# EAGLE design usb-eeprom (EAGLE 6.6.0)
28Cxxx EEPROM Programmer Schematic http://github.com/sstallion/usb-eeprom
REV: 1.01
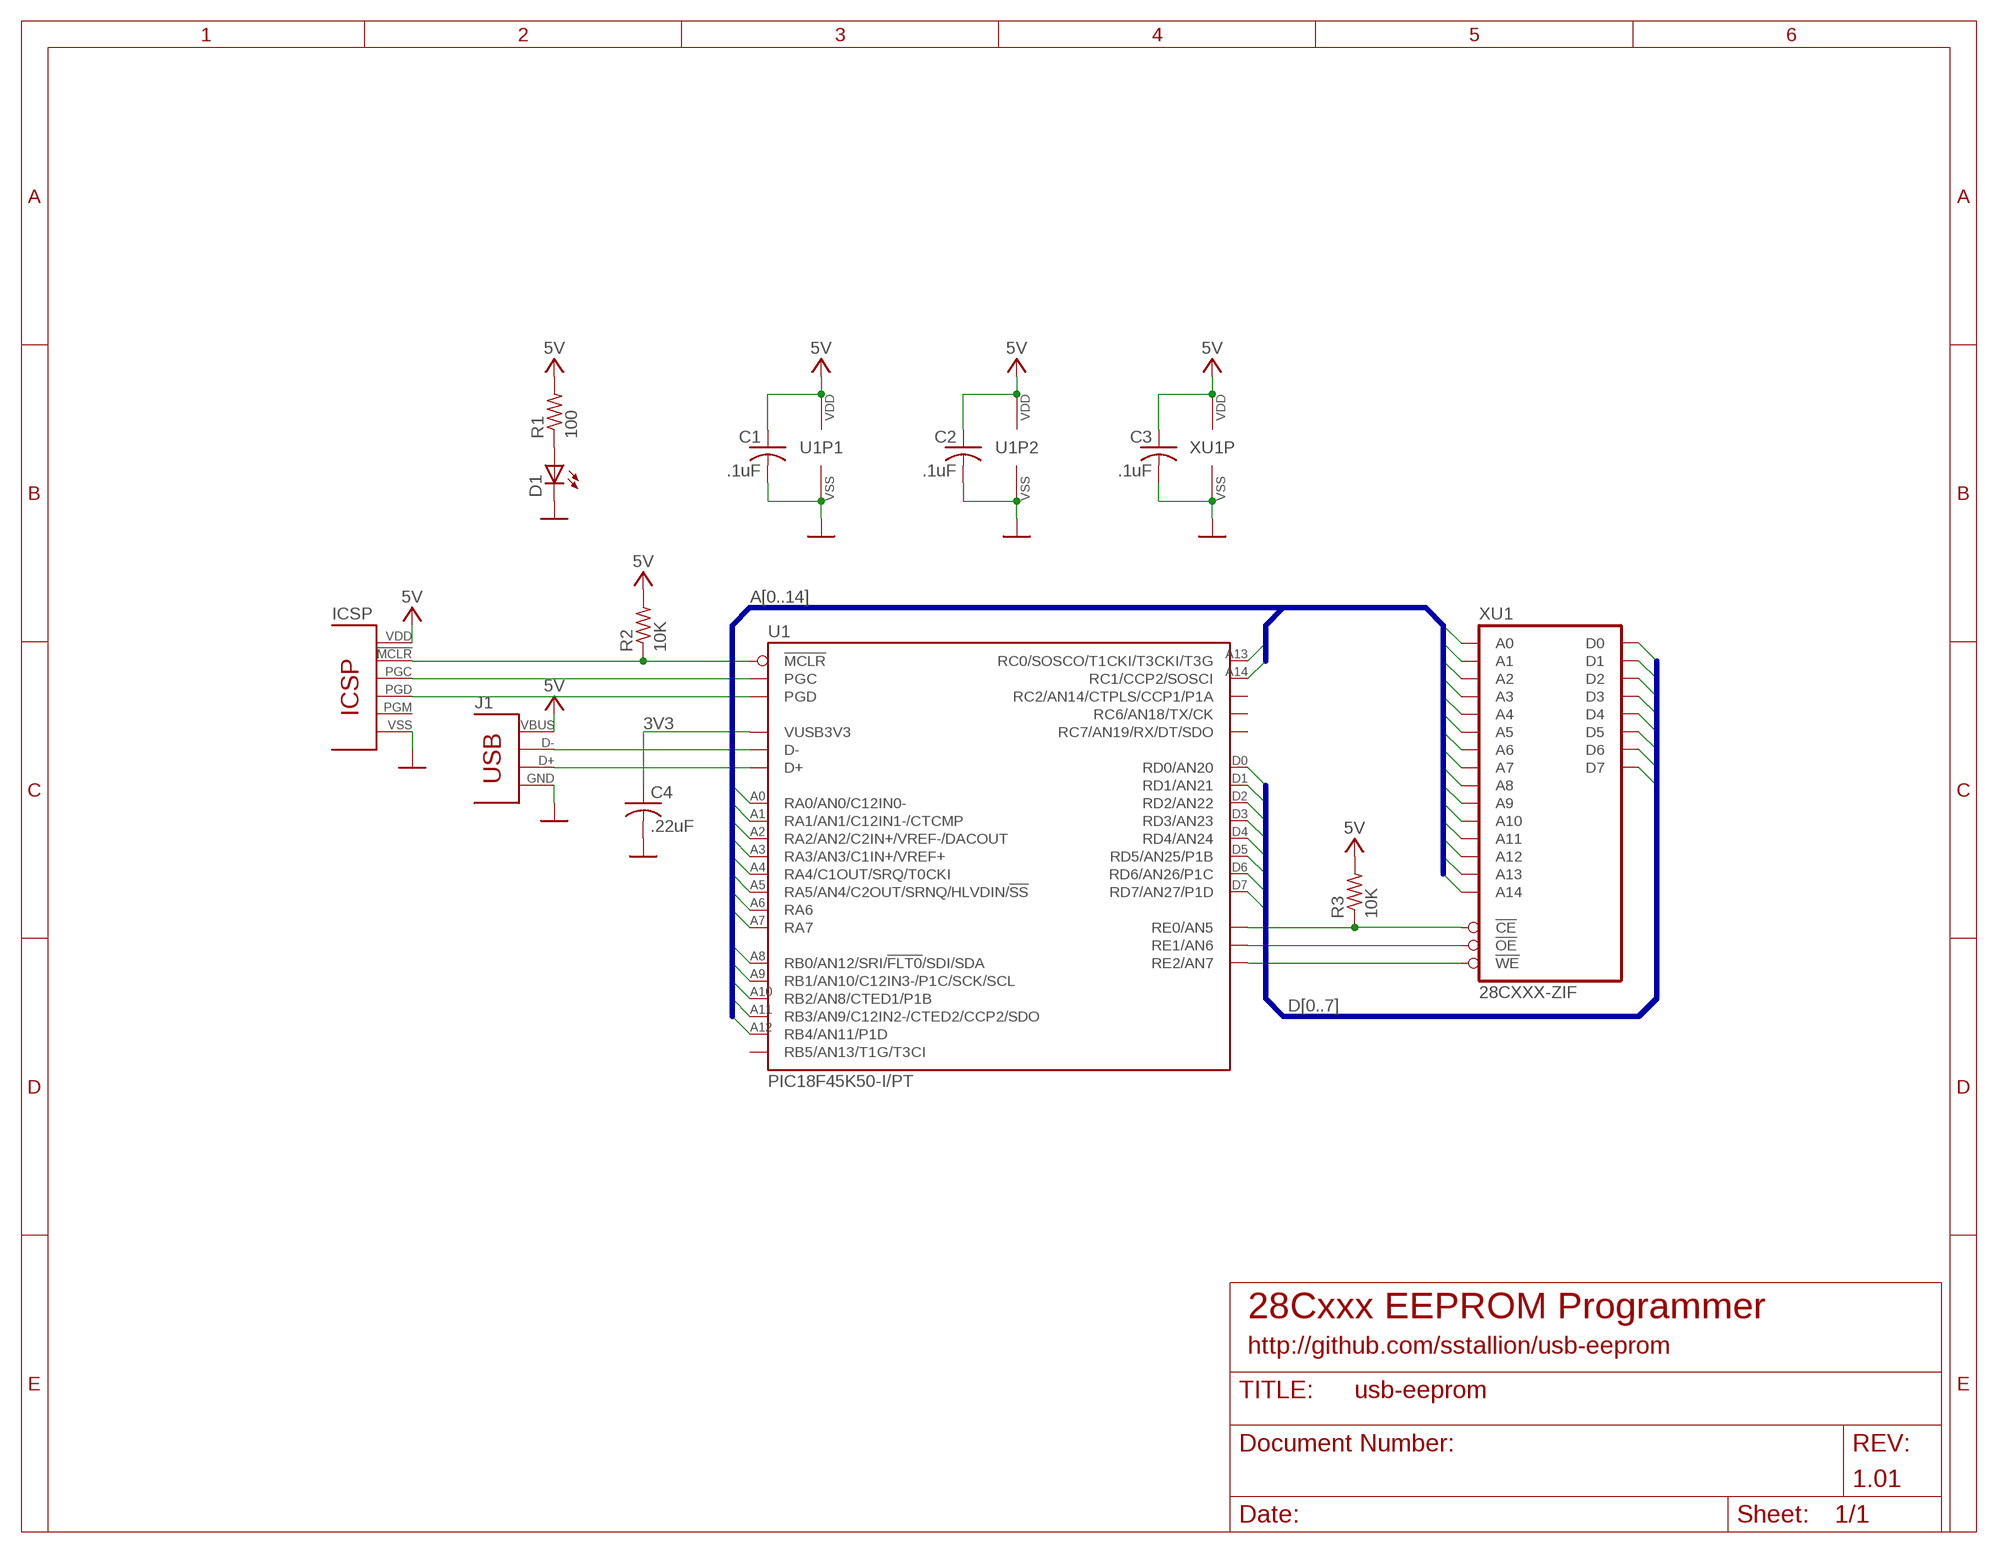
[diagram p0: schematic, sheet 1]

## Parts
C1  .1uF  C-USC0805  [C0805]
C2  .1uF  C-USC0805  [C0805]
C3  .1uF  C-USC0805  [C0805]
C4  .22uF  C-USC0805  [C0805]
D1  BLUE  LEDSML0805  [SML0805]
ICSP  ICSP  [ICSP]
J1  USBA  [USBA]
R1  100  R-US_R0805  [R0805]
R2  10K  R-US_R0805  [R0805]
R3  10K  R-US_R0805  [R0805]
U1  PIC18F45K50-I/PT  [TQFP44]
XU1  28CXXX-ZIF  [ZIF28]

## Nets
+5V: C1.1 C2.1 C3.1 ICSP.2(VDD) J1.1 R1.2 R2.2 R3.2 U1.7(VDD) U1.28(VDD) XU1.28(VDD) ; supply symbol labelled 5V
A0: U1.19(RA0/AN0/C12IN0-) XU1.10(A0)
A1: U1.20(RA1/AN1/C12IN1-/CTCMP) XU1.9(A1)
A2: U1.21(RA2/AN2/C2IN+/VREF-/DACOUT) XU1.8(A2)
A3: U1.22(RA3/AN3/C1IN+/VREF+) XU1.7(A3)
A4: U1.23(RA4/C1OUT/SRQ/T0CKI) XU1.6(A4)
A5: U1.24(RA5/AN4/C2OUT/SRNQ/HLVDIN/!SS!) XU1.5(A5)
A6: U1.31(RA6) XU1.4(A6)
A7: U1.30(RA7) XU1.3(A7)
A8: U1.8(RB0/AN12/SRI/!FLT0!/SDI/SDA) XU1.25(A8)
A9: U1.9(RB1/AN10/C12IN3-/P1C/SCK/SCL) XU1.24(A9)
A10: U1.10(RB2/AN8/CTED1/P1B) XU1.21(A10)
A11: U1.11(RB3/AN9/C12IN2-/CTED2/CCP2/SDO) XU1.23(A11)
A12: U1.14(RB4/AN11/P1D) XU1.2(A12)
A13: U1.32(RC0/SOSCO/T1CKI/T3CKI/T3G) XU1.26(A13)
A14: U1.35(RC1/CCP2/SOSCI) XU1.1(A14)
D0: U1.38(RD0/AN20) XU1.11(D0)
D1: U1.39(RD1/AN21) XU1.12(D1)
D2: U1.40(RD2/AN22) XU1.13(D2)
D3: U1.41(RD3/AN23) XU1.15(D3)
D4: U1.2(RD4/AN24) XU1.16(D4)
D5: U1.3(RD5/AN25/P1B) XU1.17(D5)
D6: U1.4(RD6/AN26/P1C) XU1.18(D6)
D7: U1.5(RD7/AN27/P1D) XU1.19(D7)
GND: C1.2 C2.2 C3.2 C4.2 D1.C ICSP.3(VSS) J1.4 J1.5 J1.6 U1.6(VSS) U1.29(VSS) XU1.14(VSS)
N$1: ICSP.1(!MCLR) R2.1 U1.18(!MCLR)
N$2: ICSP.5(PGC) U1.16(PGC)
N$3: ICSP.4(PGD) U1.17(PGD)
N$4: C4.1 U1.37(VUSB3V3)
N$5: R3.1 U1.25(RE0/AN5) XU1.20(!CE)
N$6: J1.2 U1.42(D-)
N$7: J1.3 U1.43(D+)
N$8: U1.26(RE1/AN6) XU1.22(!OE)
N$9: U1.27(RE2/AN7) XU1.27(!WE)
N$10: D1.A R1.1
Unconnected: ICSP.6(PGM) U1.1(RC7/AN19/RX/DT/SDO) U1.15(RB5/AN13/T1G/T3CI) U1.36(RC2/AN14/CTPLS/CCP1/P1A) U1.44(RC6/AN18/TX/CK)

## Buses
A[0..14]
D[0..7]

## Notes on the sheet
- 3V3
- 28Cxxx EEPROM Programmer
- http://github.com/sstallion/usb-eeprom

## Library data of the parts
C1-C3 = rcl:C-US: CAPACITOR, American symbol; MFG: Vishay; MFG_PN: VJ0805Y104KXJCW1BC; MOUSER_PN: 77-VJ0805Y104KXJCBC; NOTES: X7R MLCC 10% 16V
C4 = rcl:C-US: CAPACITOR, American symbol; MFG: Vishay; MFG_PN: VJ0805Y224KXJTW1BC; MOUSER_PN: 77-VJ0805Y224KXJTBC; NOTES: X7R MLCC 10% 16V
D1 = led:LED: LED OSRAM: - CHIPLED LG R971, LG N971, LY N971, LG Q971, LY Q971, LO R971, LY R971 LH N974, LH R974 LS Q976, LO Q976, LY Q976 LO Q996 - Hyper CHIPLED LW Q18S LB Q993, LB Q99A, LB R99A - SideLED LS A670, LO A670, LY A670, LG A670, LP A670 LB A673, LV A673, LT A673, LW A673 LH A674 LY A675 LS A676, LA A676, LO A676, LY A676, LW A676 LS A679, LY A679, LG A679 - Hyper Micro SIDELED® LS Y876, LA Y876, LO Y876, LY Y876 LT Y87S - SmartLED LW L88C, LW L88S LB L89C, LB L89S, LG L890 LS L89K, LO L89K, LY L89K LS L896, LA L896, LO L896, LY L896 - TOPLED LS T670, LO T670, LY T670, LG T670, LP T670 LSG T670, LSP T670, LSY T670, LOP T670, LYG T670 LG T671, LOG T671, LSG T671 LB T673, LV T673, LT T673, LW T673 LH T674 LS T676, LA T676, LO T676, LY T676, LB T676, LH T676, LSB T676, LW T676 LB T67C, LV T67C, LT T67C, LS T67K, LO T67K, LY T67K, LW E67C LS E67B, LA E67B, LO E67B, LY E67B, LB E67C, LV E67C, LT E67C LW T67C LS T679, LY T679, LG T679 LS T770, LO T770, LY T770, LG T770, LP T770 LB T773, LV T773, LT T773, LW T773 LH T774 LS E675, LA E675, LY E675, LS T675 LS T776, LA T776, LO T776, LY T776, LB T776 LHGB T686 LT T68C, LB T68C - Hyper Mini TOPLED® LB M676 - Mini TOPLED Santana® LG M470 LS M47K, LO M47K, LY M47K Source: http://www.osram.convergy.de LUXEON: - LUMILED® LXK2-PW12-R00, LXK2-PW12-S00, LXK2-PW14-U00, LXK2-PW14-V00 LXK2-PM12-R00, LXK2-PM12-S00, LXK2-PM14-U00 LXK2-PE12-Q00, LXK2-PE12-R00, LXK2-PE12-S00, LXK2-PE14-T00, LXK2-PE14-U00 LXK2-PB12-K00, LXK2-PB12-L00, LXK2-PB12-M00, LXK2-PB14-N00, LXK2-PB14-P00, LXK2-PB14-Q00 LXK2-PR12-L00, LXK2-PR12-M00, LXK2-PR14-Q00, LXK2-PR14-R00 LXK2-PD12-Q00, LXK2-PD12-R00, LXK2-PD12-S00 LXK2-PH12-R00, LXK2-PH12-S00 LXK2-PL12-P00, LXK2-PL12-Q00, LXK2-PL12-R00 Source: www.luxeon.com KINGBRIGHT: KA-3528ASYC Source: www.kingbright.com; MFG: Kingbright; MFG_PN: APT2012QBC/D; MOUSER_PN: 604-APT2012QBC/D; NOTES: 3.3V 20mA
ICSP = usb-eeprom:ICSP: In Circuit Serial Programming
J1 = usb-eeprom:USB: USB Connector; MFG: Molex; MFG_PN: 48037-0001; MOUSER_PN: 538-48037-0001; NOTES: MALE A CONNECTOR
R1 = rcl:R-US_: RESISTOR, American symbol; MFG: Vishay; MFG_PN: CRCW0805100RFKEA; MOUSER_PN: 71-CRCW0805-100-E3; NOTES: 1/8W 1%
R2 R3 = rcl:R-US_: RESISTOR, American symbol; MFG: Vishay; MFG_PN: CRCW080510K0FKEB; MOUSER_PN: 71-CRCW080510K0FKEB; NOTES: 1/8W 1%
U1 = usb-eeprom:PIC18F45K50: 40/44-Pin, Low-Power, High-Performance Microcontrollers with XLP Technology; MFG: Microchip Technology; MFG_PN: PIC18F45K50-I/PT; MOUSER_PN: 579-PIC18F45K50-I/PT; NOTES: 48MHz 32KB FLASH 2KB RAM
XU1 = usb-eeprom:28CXXX-ZIF: 28Cxxx ZIF Socket; MFG: 3M; MFG_PN: 228-1371-00-0602J; MOUSER_PN: 517-228-1371-00; NOTES: 28 PIN ZIF SOCKET

## Board
28Cxxx EEPROM Programmer Board Layout http://github.com/sstallion/usb-eeprom
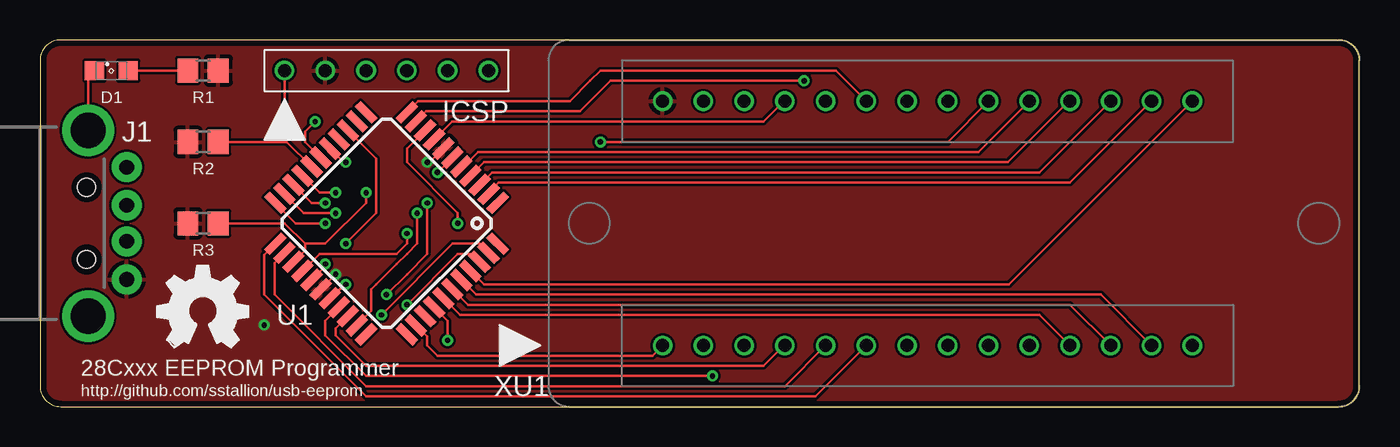
[diagram p1: board, top side]
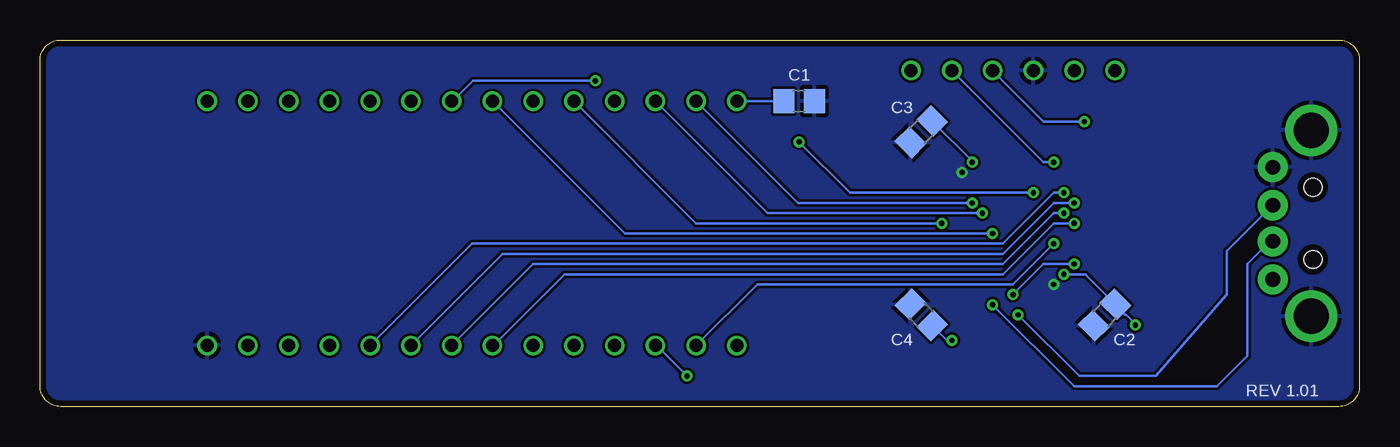
[diagram p2: board, bottom side, seen from below]

Size 82.23 x 22.86 mm. Coordinates in mm from the lower left corner, seen from the top.
Outline: 0,21.59 0,1.27 arc90 1.27,0 80.96,0 arc90 82.23,1.27 82.23,21.59 arc90 80.96,22.86 1.27,22.86 arc90 0,21.59
Copper layers (1*16): Top 0.0356mm / dielectric 1.5011mm / Bottom 0.0356mm
Design rules "oshpark *": minimum track width 6mil, minimum drill 13mil, track to track 6mil, track to pad 6mil, pad to pad 6mil, via to via 6mil, smd to smd 6mil, copper to edge 15mil, drill to drill 6mil, minimum pad ring 7mil, minimum via ring 7mil, stop-mask expansion 3mil, vias tented up to drill 20mil, thermal gap 10mil

### Footprints (pad centres in the part's own frame; a part is rotated, then mirrored left to right if it is on the bottom)
C0805 = smd 1.3 x 1.5: 1 -0.95,0; 2 0.95,0
SML0805 = smd 1.2 x 1.2: A 1.05,0; C -1.05,0
ICSP = drill 0.813: 1 -6.35,0; 2 -3.81,0; 3 -1.27,0; 4 1.27,0; 5 3.81,0; 6 6.35,0
USBA = drill 0.914 pad 1.88: 1 2.4,-3.5; 2 2.4,-1.127; 3 2.4,1.127; 4 2.4,3.5 | drill 2.2: 5 0,-5.8; 6 0,5.8 | hole 1.1: -0.1,2.25; -0.1,-2.25
R0805 = smd 1.3 x 1.5: 1 -0.95,0; 2 0.95,0
TQFP44 = smd 1.5 x 0.5: 1 -5.8,4; 2 -5.8,3.2; 3 -5.8,2.4; 4 -5.8,1.6; 5 -5.8,0.8; 6 -5.8,0; 7 -5.8,-0.8; 8 -5.8,-1.6; 9 -5.8,-2.4; 10 -5.8,-3.2; 11 -5.8,-4; 23 5.8,-4; 24 5.8,-3.2; 25 5.8,-2.4; 26 5.8,-1.6; 27 5.8,-0.8; 28 5.8,0; 29 5.8,0.8; 30 5.8,1.6; 31 5.8,2.4; 32 5.8,3.2; 33 5.8,4 | smd 0.5 x 1.5: 12 -4,-5.8; 13 -3.2,-5.8; 14 -2.4,-5.8; 15 -1.6,-5.8; 16 -0.8,-5.8; 17 0,-5.8; 18 0.8,-5.8; 19 1.6,-5.8; 20 2.4,-5.8; 21 3.2,-5.8; 22 4,-5.8; 34 4,5.8; 35 3.2,5.8; 36 2.4,5.8; 37 1.6,5.8; 38 0.8,5.8; 39 0,5.8; 40 -0.8,5.8; 41 -1.6,5.8; 42 -2.4,5.8; 43 -3.2,5.8; 44 -4,5.8
ZIF28 = drill 0.813: 1 -16.51,-7.62; 2 -13.97,-7.62; 3 -11.43,-7.62; 4 -8.89,-7.62; 5 -6.35,-7.62; 6 -3.81,-7.62; 7 -1.27,-7.62; 8 1.27,-7.62; 9 3.81,-7.62; 10 6.35,-7.62; 11 8.89,-7.62; 12 11.43,-7.62; 13 13.97,-7.62; 14 16.51,-7.62; 15 16.51,7.62; 16 13.97,7.62; 17 11.43,7.62; 18 8.89,7.62; 19 6.35,7.62; 20 3.81,7.62; 21 1.27,7.62; 22 -1.27,7.62; 23 -3.81,7.62; 24 -6.35,7.62; 25 -8.89,7.62; 26 -11.43,7.62; 27 -13.97,7.62; 28 -16.51,7.62

### Placement (x,y rotation side)
C1  34.92,19.05 0 bottom
C2  15.88,5.71 225 bottom
C3  27.3,17.14 225 bottom
C4  27.3,5.71 135 bottom
D1  4.45,20.95 0 top
ICSP  21.59,20.95 0 top
J1  3,11.43 0 top
LOGO  [OSHW]  7.3,3.68 0 top
R1  10.16,20.95 0 top
R2  10.16,16.51 180 top
R3  10.16,11.43 180 top
U1  21.59,11.43 225 top
XU1  55.31,11.43 0 top

### Tracks (layer width: path | path; a pad name or v marks a point on that pad's centre or on a via)
+5V  (via drill 0.33 pad 0.69)
  Top 0.152: U1.28 v18.41,8.26 | U1.7 24.27,15.24 v24.13,15.24
  Bottom 0.152: C2.1 17.07,8.26 v18.41,8.26 | C3.1 24.13,15.31 v24.13,15.24 | C2.1 15.2,6.31 14.61,5.71 | XU1.28 C1.1 | v13.97,5.08 13.97,5.15 C2.1
  pour Top: 1.31,0.01 80.96,0 arc90 82.23,1.27 82.23,21.59 arc90 80.96,22.86 1.27,22.86 arc90 0,21.59 0.04,1.31 arc92
A0  (via drill 0.33 pad 0.69)
  Top 0.152: U1.19 17.42,13.34 v18.41,13.34
  Bottom 0.152: v18.41,13.34 19.05,13.34 22.23,10.16 53.98,10.16 55.31,10.16 XU1.10
A1  (via drill 0.33 pad 0.69)
  Top 0.152: U1.20 16.93,12.7 v17.78,12.7
  Bottom 0.152: v17.78,12.7 19.05,12.7 22.23,9.53 52.7,9.53 53.4,9.53 XU1.9
A2  (via drill 0.33 pad 0.69)
  Top 0.152: U1.21 16.43,12.06 v18.41,12.06
  Bottom 0.152: v18.41,12.06 19.05,12.06 22.23,8.89 50.8,8.89 51.5,8.89 XU1.8
A3  (via drill 0.33 pad 0.69)
  Top 0.152: U1.22 15.93,11.43 v17.78,11.43
  Bottom 0.152: v17.78,11.43 19.05,11.43 22.23,8.26 49.53,8.26 54.04,3.75 XU1.7
A4
  Top 0.152: U1.23 13.97,9.47 13.97,6.99 20.32,0.64 47.62,0.64 48.32,0.64 XU1.6
A5
  Top 0.152: U1.24 14.61,8.97 14.61,6.99 20.32,1.27 46.35,1.27 46.42,1.27 XU1.5
A6
  Top 0.152: U1.31 18.41,4.86 18.41,4.45 20.32,2.54 45.09,2.54 46.35,3.81 XU1.4
A7  (via drill 0.33 pad 0.69)
  Top 0.152: U1.30 17.78,5.36 17.78,4.45 20.32,1.91 v41.91,1.91
  Bottom 0.152: v41.91,1.91 43.81,3.81 XU1.3
A8
  Top 0.152: U1.8 25.68,17.78 45.09,17.78 46.35,19.05 XU1.25
A9  (via drill 0.33 pad 0.69)
  Top 0.152: v26.04,11.43 26.04,12.06 22.86,15.24 22.86,16.09 U1.9
  Bottom 0.152: XU1.24 41.34,11.43 v26.04,11.43
A10  (via drill 0.33 pad 0.69)
  Top 0.152: U1.10 24.05,18.41 33.66,18.41 35.56,20.32 v47.62,20.32
  Bottom 0.152: v47.62,20.32 55.24,20.32 56.52,19.05 XU1.21
A11
  Top 0.152: U1.11 23.55,19.05 33.02,19.05 34.29,20.32 34.92,20.95 49.53,20.95 49.59,20.95 XU1.23
A12  (via drill 0.33 pad 0.69)
  Top 0.152: 19.19,17.01 U1.14 20.95,15.46 20.95,15.24 20.95,12.06 v19.05,10.16
  Bottom 0.152: XU1.2 37.53,7.62 21.59,7.62 v19.05,10.16
A13  (via drill 0.33 pad 0.69)
  Top 0.152: v23.5,12.06 23.5,10.16 22.86,9.53 22.23,8.89 20.95,7.62 20.64,7.3 20.64,6.35 20.64,5.95 U1.32 19.75,5.15
  Bottom 0.152: v23.5,12.06 36.2,12.06 36.89,12.06 XU1.26
A14
  Top 0.152: XU1.1 38.16,3.17 38.1,3.17 25.32,3.17 24.77,3.17 24.13,3.81 24.13,4.37 U1.35
D0
  Top 0.152: U1.38 26.17,5.71 61.59,5.71 62.29,5.71 XU1.11
D1
  Top 0.152: XU1.12 64.2,6.35 26.67,6.35 U1.39 | U1.39
D2
  Top 0.152: XU1.13 66.1,6.99 41.91,6.99 27.17,6.99 U1.40
D3
  Top 0.152: U1.41 27.66,7.62 60.33,7.62 60.39,7.62 XU1.15
D4
  Top 0.152: XU1.16 64.2,13.97 28.57,13.97 27.95,13.35 U1.2
D5
  Top 0.152: XU1.17 62.29,14.61 28.57,14.61 28.16,14.61 U1.3
D6
  Top 0.152: U1.4 27.66,15.24 60.33,15.24 64.14,19.05 XU1.18
D7
  Top 0.152: XU1.19 58.48,15.88 58.42,15.88 27.3,15.88 26.4,14.97 U1.5
GND  (via drill 0.33 pad 0.69)
  Top 0.152: D1.C 3,20.56 J1.6 | v24.77,14.61 U1.6 | v19.05,7.62 U1.29
  pour Bottom: 82.23,21.59 82.23,1.27 arc-90 80.96,0 1.27,0 arc-90 0,1.27 0,21.59 arc-90 1.27,22.86 80.96,22.86 arc-90
N$1
  Top 0.152: 11.11,16.82 R2.1 15.38,16.51 | 15.38,16.51 U1.18 | ICSP.1 15.24,16.65 15.38,16.51
N$2  (via drill 0.33 pad 0.69)
  Top 0.152: 18.05,16.24 U1.16 | 18.19,16.1 U1.16 | U1.16 18.91,15.24 v19.05,15.24
  Bottom 0.152: ICSP.5 19.68,15.24 v19.05,15.24
N$3  (via drill 0.33)
  Top 0.152: U1.17 | U1.17 | U1.17 16.51,16.51 | 16.51,16.51 | 16.51,16.51 16.51,17.14 v17.14,17.78
  Bottom 0.152: ICSP.4 19.68,17.78 v17.14,17.78
N$4  (via drill 0.33 pad 0.69)
  Top 0.152: U1.37 25.4,5.36 v25.4,4.13
  Bottom 0.152: 26.91,4.76 C4.1 25.72,4.13 v25.4,4.13
N$5  (via drill 0.33 pad 0.69)
  Top 0.152: XU1.20 56.58,16.51 v34.92,16.51 | R3.1 15.24,11.43 16.51,10.16 | v20.32,13.34 20.32,12.7 17.78,10.16 17.14,10.16 16.51,10.16 | U1.25 16.51,9.74 16.51,10.16
  Bottom 0.152: v34.92,16.51 31.75,13.34 30.8,13.34 29.84,13.34 23.5,13.34 v20.32,13.34
N$6  (via drill 0.33 pad 0.69)
  Top 0.152: U1.42 26.89,9.53 26.04,9.53 v22.86,6.35
  Bottom 0.152: v22.86,6.35 17.78,1.27 15.24,1.27 8.89,1.27 6.99,3.17 6.99,8.26 6.99,8.89 5.57,10.3 J1.2
N$7  (via drill 0.33 pad 0.69)
  Top 0.152: U1.43 27.39,10.16 25.72,10.16 v21.27,5.71
  Bottom 0.152: v21.27,5.71 17.46,1.91 15.88,1.91 12.7,1.91 8.26,6.99 8.26,9.53 8.26,9.7 J1.3
N$8  (via drill 0.33 pad 0.69)
  Top 0.152: v22.86,10.79 22.86,10.16 22.23,9.53 21.59,9.53 17.42,9.53 U1.26
  Bottom 0.152: XU1.22 45.78,10.79 v22.86,10.79
N$9  (via drill 0.33 pad 0.69)
  Top 0.152: v24.13,12.7 24.13,10.79 24.13,10.16 24.13,9.53 22.86,8.26 v21.59,6.99 | U1.27 17.78,8.75 v17.78,8.89
  Bottom 0.152: XU1.27 34.99,12.7 31.75,12.7 v24.13,12.7 | v21.59,6.99 19.68,8.89 v17.78,8.89
N$10
  Top 0.152: D1.A R1.1

### Text on the board
tNames: 28Cxxx EEPROM Programmer | http://github.com/sstallion/usb-eeprom
bNames: REV 1.01